# Altium project Multi_power_supply.PrjPcb
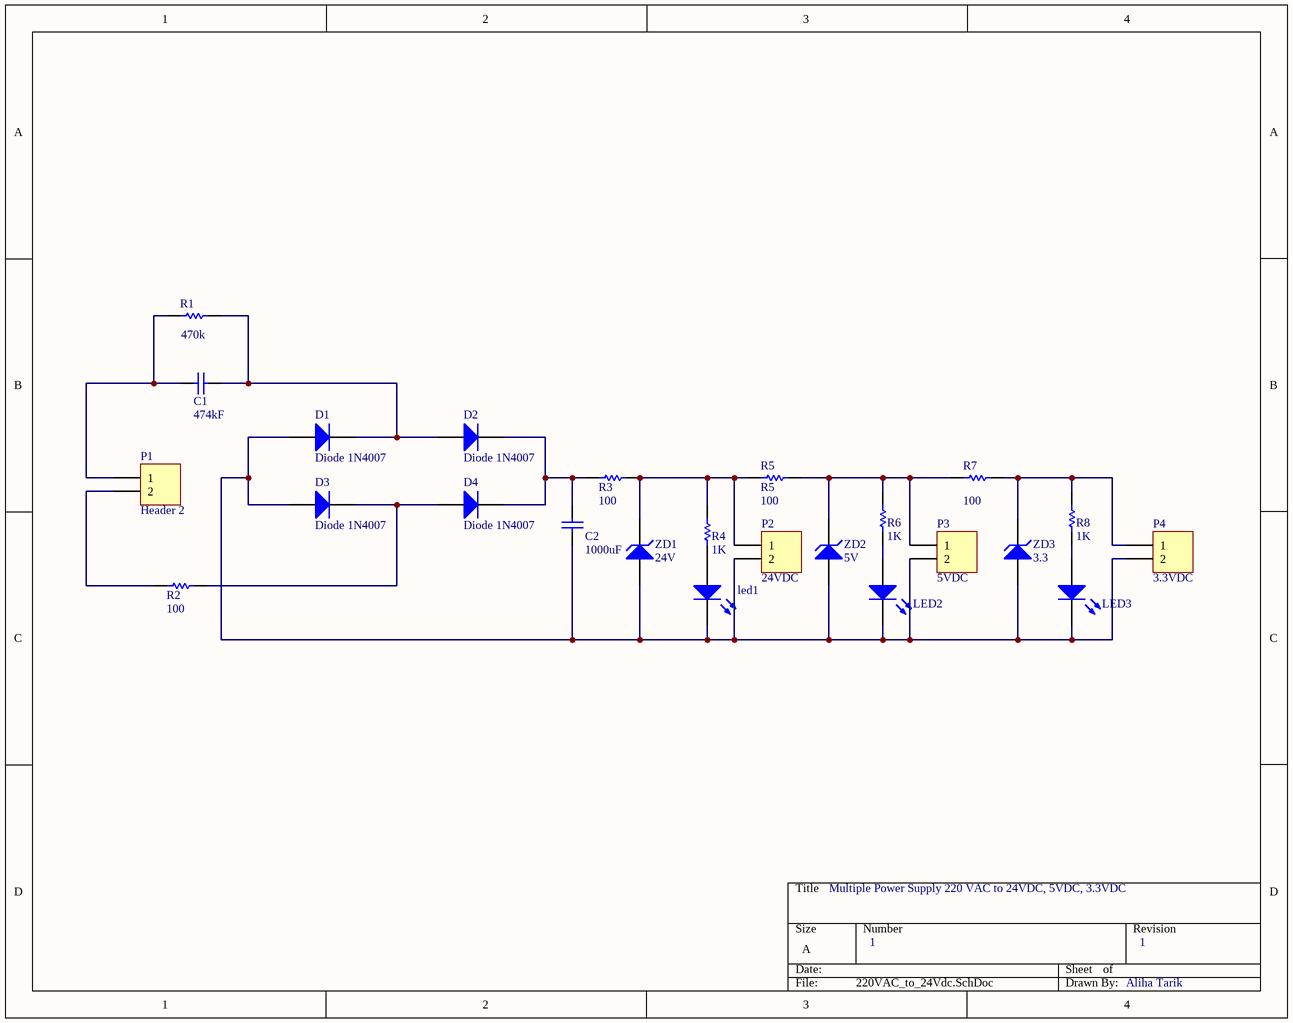
[diagram p0: 220VAC_to_24Vdc.SchDoc]
1 sheet, 24 parts. Net scope: global (net labels, ports and power ports of the same name join across sheets).
Board file: 220VAC_to_24Vdc.PcbDoc

## Sheet 220VAC_to_24Vdc.SchDoc
size A

### Parts
C1  C1  C1: 474kF  [RAD-0.3]
C2  C2  value 1000uF  [RAD-0.3]
D1  Diode 1N4007  [DO-41]
D2  Diode 1N4007  [DO-41]
D3  Diode 1N4007  [DO-41]
D4  Diode 1N4007  [DO-41]
led1  LED1  [3.2X1.6X1.1]  (value not drawn)
led2  LED2  [3.2X1.6X1.1]
led3  LED3  [3.2X1.6X1.1]
P1  Header 2  [HDR1X2]
P2  24VDC  [HDR1X2]
P3  5VDC  [HDR1X2]
P4  3.3VDC  [HDR1X2]
R1  value 470k  [AXIAL-0.5]  (hidden comment: Res Semi)
R2  R2  value 100  [AXIAL-0.5]
R3  R3  value 100  [AXIAL-0.5]
R4  R4  value 1K  [AXIAL-0.5]
R5  R5  value 100  [AXIAL-0.5]
R6  R6  value 1K  [AXIAL-0.5]
R7  value 100  [AXIAL-0.5]  (hidden comment: R3)
R8  R8  value 1K  [AXIAL-0.5]
ZD1  24V  [DIODE-0.7]
ZD2  5V  [DIODE-0.7]
ZD3  3.3  [DIODE-0.7]

### Nets
NetC1_1: C1.1 P1.1 R1.1
NetC1_2: C1.2 D1.2(K) D2.1(A) R1.2
NetC2_1: C2.1 D1.1(A) D3.1(A) led1.2(K) led2.2(K) led3.2(K) P2.2 P3.2 P4.2 ZD1.1(A) ZD2.1(A) ZD3.1(A)
NetC2_2: C2.2 D2.2(K) D4.2(K) R3.1
NetD3_2: D3.2(K) D4.1(A) R2.2
Netled1_1: led1.1(A) R4.1
Netled2_1: led2.1(A) R6.1
Netled3_1: led3.1(A) R8.1
NetP1_2: P1.2 R2.1
NetP2_1: P2.1 R3.2 R4.2 R5.1 ZD1.2(K)
NetP3_1: P3.1 R5.2 R6.2 R7.1 ZD2.2(K)
NetP4_1: P4.1 R7.2 R8.2 ZD3.2(K)

### Notes on the sheet
- Multiple Power Supply 220 VAC to 24VDC, 5VDC, 3.3VDC
- 1
- Aliha Tarik

### Library data of the parts
C1 C2 = Cap: Capacitor; Published: 8-Jun-2000; LatestRevisionDate: 17-Jul-2002; LatestRevisionNote: Re-released for DXP Platform.; PackageReference: RAD-0.3; Publisher: Altium Limited; PackageDescription: Radial Cap, Thru-Hole; 2 Leads; 0.3 in Pin Spacing
D1-D4 = Diode 1N4007: 1 Amp General Purpose Rectifier; Published: 8-Jun-2000; LatestRevisionDate: 17-Jul-2002; LatestRevisionNote: Re-released for DXP Platform.; DatasheetVersion: 1998; PackageVersion: Aug-1999; PackageReference: DO-41; Publisher: Altium Limited; PackageDescription: Diode, Axial; Body 5.2 x 2.7 mm (LxDia. max), Lead Dia. 0.86 mm (max); Code_JEDEC: DO-204-AL; ComponentLink1Description: Manufacturer Link; ComponentLink1URL: http://www.fairchildsemi.com/; ComponentLink2Description: Datasheet; ComponentLink2URL: http://www.fairchildsemi.com/ds/1N%2F1N4001.pdf
led1-led3 = LED2: Typical RED, GREEN, YELLOW, AMBER GaAs LED; Published: 8-Jun-2000; LatestRevisionDate: 17-Jul-2002; LatestRevisionNote: Re-released for DXP Platform.; PackageVersion: Feb-2002; PackageReference: 3.2X1.6X1.1; Publisher: Altium Limited; PackageDescription: SM LED; 2 Flat Leads
P1-P4 = Header 2: Header, 2-Pin; LatestRevisionDate: 17-Jul-2002; LatestRevisionNote: Re-released for DXP Platform.; Publisher: Altium Limited
R1-R8 = Res Semi: Semiconductor Resistor; Published: 8-Jun-2000; LatestRevisionDate: 17-Jul-2002; LatestRevisionNote: Re-released for DXP Platform.; PackageReference: AXIAL-0.5; Publisher: Altium Limited; PackageDescription: Axial Device, Thru-Hole; 2 Leads; 0.5 in Pin Spacing
ZD1-ZD3 = D Zener: Zener Diode; Published: 8-Jun-2000; LatestRevisionDate: 17-Jul-2002; LatestRevisionNote: Re-released for DXP Platform.; PackageReference: DIODE-0.7; Publisher: Altium Limited; PackageDescription: Diode, Thru-Hole; 2 Leads; 0.7 in Pin Spacing